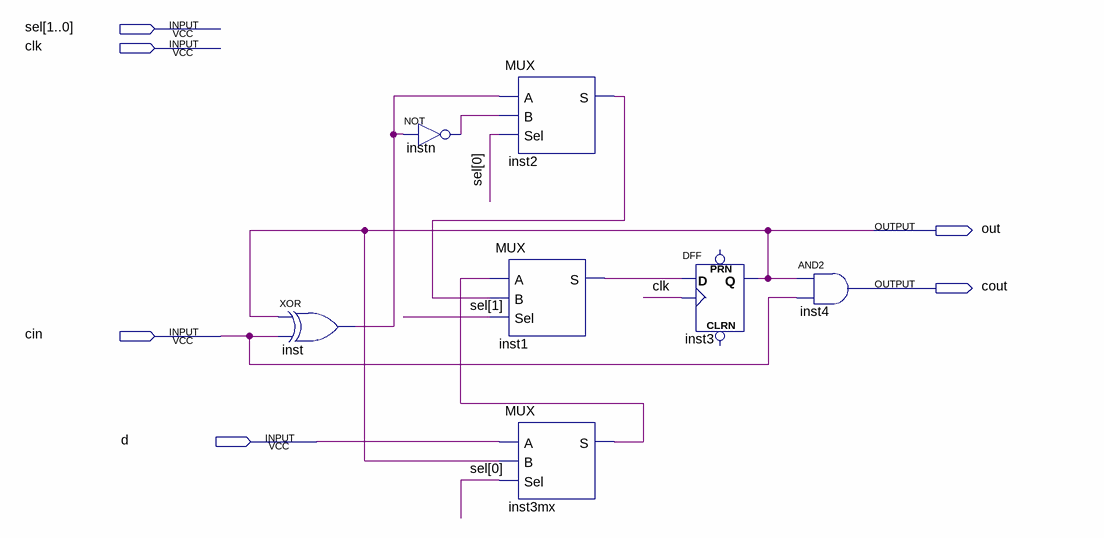
[diagram p0: schematic sheet]
// Quartus schematic breg.bdf as structural Verilog: 7 symbols, 6 pins
module breg (
  input  [1:0] sel,
  input  clk,
  input  cin,
  input  d,
  output out,
  output cout
);

  wire inst1_s, inst2_s, inst3mx_s, inst_out, instn_out;

  xor inst (inst_out, out, cin);
  not instn (instn_out, inst_out);
  MUX inst2 (.A(inst_out), .B(instn_out), .Sel(sel[0]), .S(inst2_s));
  MUX inst1 (.A(inst3mx_s), .B(inst2_s), .Sel(sel[1]), .S(inst1_s));
  MUX inst3mx (.A(d), .B(out), .Sel(sel[0]), .S(inst3mx_s));
  DFF inst3 (.CLK(clk), .D(inst1_s), .Q(out));  // open: CLRN, PRN
  and inst4 (cout, out, cin);
endmodule
